# Altium schematic sheet Loop_Filter_AD8065.SchDoc
size A4; SheetNumber: 14; SheetTotal: 27
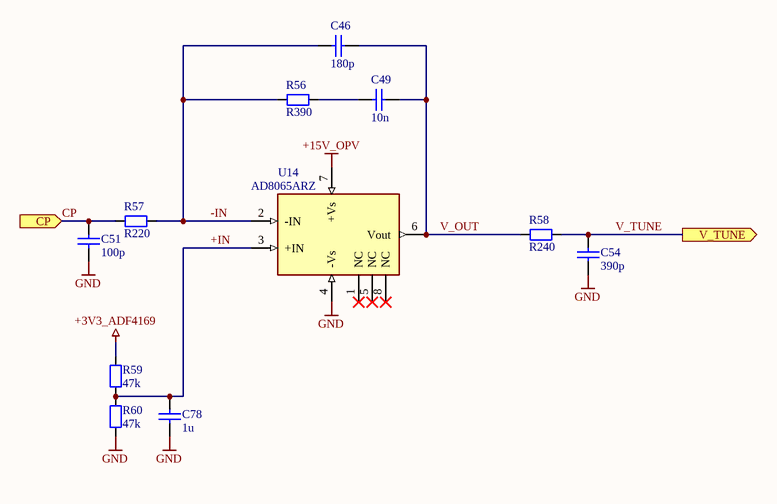
[diagram p0: Loop_Filter_AD8065.SchDoc]

## Parts
C46  180p  [C_0603_1608Metric_IPC_N]
C49  10n  [C_0603_1608Metric_IPC_N]
C51  100p  [C_0603_1608Metric_IPC_N]
C54  390p  [C_0603_1608Metric_IPC_N]
C78  1u  [C_0603_1608Metric_IPC_N]
R56  R390  [R_0603_1608Metric_IPC_N]
R57  R220  [R_0603_1608Metric_IPC_N]
R58  R240  [R_0603_1608Metric_IPC_N]
R59  47k  [R_0603_1608Metric_IPC_N]
R60  47k  [R_0603_1608Metric_IPC_N]
U14  AD8065ARZ  [SOIC-8_3.9x4.9mm_P1.27mm_IPC_N]

## Ports
CP (in, see Top_Level[2B], PLL_ADF4169[6B]), V_TUNE (out, see Top_Level[3B])

## Nets
+3V3_ADF4169: R59.2
+15V_OPV: U14.7(+Vs)
GND: C51.2 C54.1 C78.1 R60.1 U14.4(-Vs)
+IN: C78.2 R59.1 R60.2 U14.3(+IN)
-IN: C46.2 R56.2 R57.1 U14.2(-IN)
CP: C51.1 R57.2 ; port CP
V_OUT: C46.1 C49.1 R58.2 U14.6(Vout)
V_TUNE: C54.2 R58.1 ; port V_TUNE
NetC49_2: C49.2 R56.1

Not connected (* = marked no-connect by the designer): U14 1(NC)* 5(NC)* 8(NC)*

## Library data of the parts
C46 C49 C51 C54 C78 = C000003: Generic MLCC with 0603 Footprint; Specific Component: False; ID: C000003; Tolerance: *; Temp Coefficient: *; Voltage Rated: *; min Temperature: *; max Temperature: *; Case: 0603
  C46: Capacitance: 180p
  C49: Capacitance: 10n
  C51: Capacitance: 100p
  C54: Capacitance: 390p
  C78: Capacitance: 1u
R56-R60 = R000003: Generic Chip Resistor with 0603 Footprint; Specific Component: False; ID: R000003; Tolerance: *; Power Rating: *; Composition: *; min Temperature: *; max Temperature: *; Temp Coefficient: *; Case: 0603
  R56: Resistance: R390
  R57: Resistance: R220
  R58: Resistance: R240
  R59 R60: Resistance: 47k
U14 = AMP000003: Manufacturer: Analog Devices; ID: AMP000003; Type: FastFET Op Amps; Manufacturer Part Number: AD8065ARZ; Part Value: AD8065ARZ; Case: SOIC-8; ComponentLink1Description: Datasheet; ComponentLink1URL: https://www.analog.com/media/en/technical-documentation/data-sheets/ad8065_8066.pdf; Supplier 1: Mouser; Supplier Part Number 1: 584-AD8065ARZ; Supplier 2: Digikey; Supplier Part Number 2: 505-AD8065ARZ-ND